# Altium schematic sheet Extension_Connectors.SchDoc: Init Title in DocParam
size A3; Organization: Use Organization_Name in ProjParam; Address1: Eliot Ferragni; Address2: STI-IMT-LSRO; Address3: EPFL; Address4: CH-1015 LAUSANNE; DocumentNumber: 8; Revision: A; SheetNumber: 8; SheetTotal: 10; ApprovedBy: Init ApprovedBy in DocParam; CheckedBy: Init CheckedBy in DocParam; Author: Init Author in DocParam; CompanyName: Init CompanyName in DocParam; DrawnBy: Init DrawBy in DocParam; Engineer: Init Engineer in DocParam; Title2: Init Title2 in DocParam; DocumentName: Init DocumentName in DocParam; ProjectName: Init ProjectName in DocParam
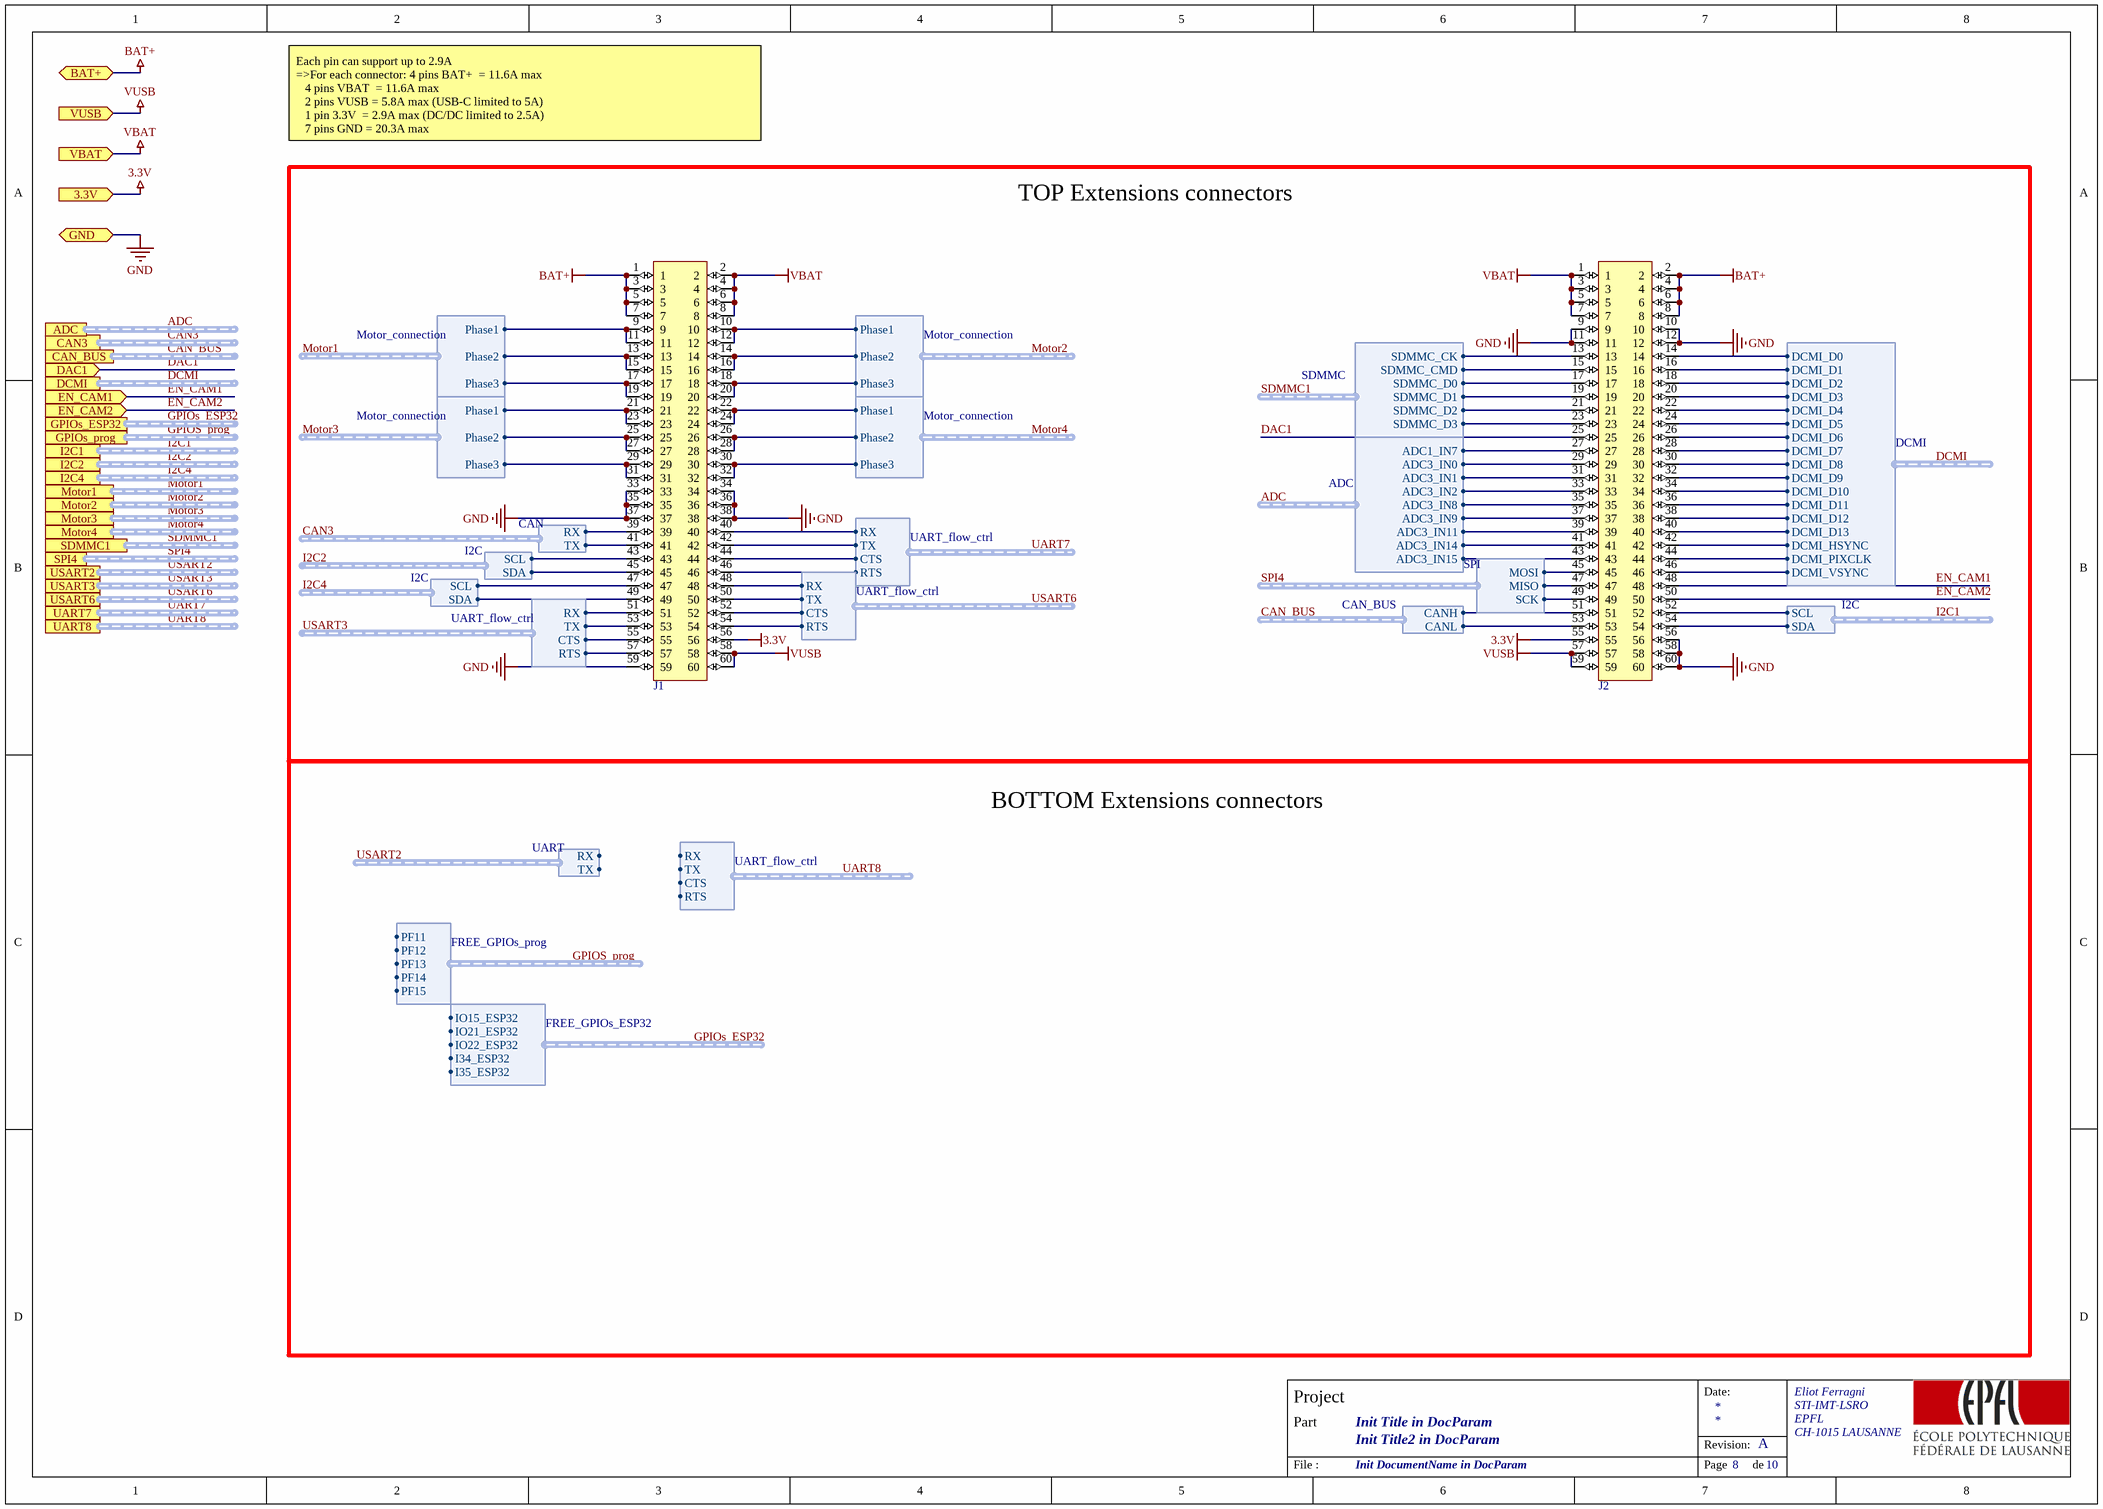
[diagram p0: Extension_Connectors.SchDoc]

## Parts
J1  FLE-130-01-G-DV-A  [FLE-130-01-G-DV-A]  (value not drawn)
J2  FLE-130-01-G-DV-A  [FLE-130-01-G-DV-A]  (value not drawn)

## Blocks framed on the sheet
TOP Extensions connectors: J1 J2

## Ports
3.3V (in), ADC (harness ADC), BAT+ (bidir), CAN3 (harness CAN), CAN_BUS (harness CAN_BUS), DAC1 (in), DCMI (harness DCMI), EN_CAM1 (in), EN_CAM2 (in), GND (bidir), GPIOs_ESP32 (harness FREE_GPIOs_ESP32), GPIOs_prog (harness FREE_GPIOs_prog), I2C1 (harness I2C), I2C2 (harness I2C), I2C4 (harness I2C), Motor1 (harness Motor_connection), Motor2 (harness Motor_connection), Motor3 (harness Motor_connection), Motor4 (harness Motor_connection), SDMMC1 (harness SDMMC), SPI4 (harness SPI), UART7 (harness UART_flow_ctrl), UART8 (harness UART_flow_ctrl), USART2 (harness UART), USART3 (harness UART_flow_ctrl), USART6 (harness UART_flow_ctrl), VBAT (in), VUSB (in)

## Harnesses
I2C: SDA, SCL
CAN: TX, RX
DCMI: DCMI_D0, DCMI_D1, DCMI_D2, DCMI_D3, DCMI_D4, DCMI_D5, DCMI_D7, DCMI_D8, DCMI_D9, DCMI_D10, DCMI_D11, DCMI_D12, DCMI_D13, DCMI_HSYNC, DCMI_PIXCLK, DCMI_VSYNC, DCMI_D6
SDMMC: SDMMC_CK, SDMMC_CMD, SDMMC_D0, SDMMC_D1, SDMMC_D2, SDMMC_D3
SPI: MISO, MOSI, SCK
UART_flow_ctrl: RX, TX, CTS, RTS
ADC: ADC1_IN7, ADC3_IN0, ADC3_IN1, ADC3_IN2, ADC3_IN8, ADC3_IN9, ADC3_IN11, ADC3_IN14, ADC3_IN15
UART: RX, TX
FREE_GPIOs_prog: PF13, PF14, PF12, PF15, PF11
FREE_GPIOs_ESP32: IO22_ESP32, IO21_ESP32, I34_ESP32, IO15_ESP32, I35_ESP32
CAN_BUS: CANL, CANH
Motor_connection: Phase1, Phase2, Phase3

## Nets
3.3V: J1.56 J2.55 ; port 3.3V
BAT+: J1.1 J1.3 J1.5 J1.7 J2.2 J2.4 J2.6 J2.8 ; port BAT+
GND: J1.33 J1.34 J1.35 J1.36 J1.37 J1.38 J1.59 J2.9 J2.10 J2.11 J2.12 J2.56 J2.58 J2.60 ; port GND
VBAT: J1.2 J1.4 J1.6 J1.8 J2.1 J2.3 J2.5 J2.7 ; port VBAT
VUSB: J1.58 J1.60 J2.57 J2.59 ; port VUSB
ADC.ADC1_IN7: J2.27 ; port ADC.ADC1_IN7
ADC.ADC3_IN0: J2.29 ; port ADC.ADC3_IN0
ADC.ADC3_IN1: J2.31 ; port ADC.ADC3_IN1
ADC.ADC3_IN2: J2.33 ; port ADC.ADC3_IN2
ADC.ADC3_IN8: J2.35 ; port ADC.ADC3_IN8
ADC.ADC3_IN9: J2.37 ; port ADC.ADC3_IN9
ADC.ADC3_IN11: J2.39 ; port ADC.ADC3_IN11
ADC.ADC3_IN14: J2.41 ; port ADC.ADC3_IN14
ADC.ADC3_IN15: J2.43 ; port ADC.ADC3_IN15
CAN3.RX: J1.39 ; port CAN3.RX
CAN3.TX: J1.41 ; port CAN3.TX
CAN_BUS.CANH: J2.51 ; port CAN_BUS.CANH
CAN_BUS.CANL: J2.53 ; port CAN_BUS.CANL
DAC1: J2.25 ; port DAC1
DCMI.DCMI_D0: J2.14 ; port DCMI.DCMI_D0
DCMI.DCMI_D1: J2.16 ; port DCMI.DCMI_D1
DCMI.DCMI_D2: J2.18 ; port DCMI.DCMI_D2
DCMI.DCMI_D3: J2.20 ; port DCMI.DCMI_D3
DCMI.DCMI_D4: J2.22 ; port DCMI.DCMI_D4
DCMI.DCMI_D5: J2.24 ; port DCMI.DCMI_D5
DCMI.DCMI_D6: J2.26 ; port DCMI.DCMI_D6
DCMI.DCMI_D7: J2.28 ; port DCMI.DCMI_D7
DCMI.DCMI_D8: J2.30 ; port DCMI.DCMI_D8
DCMI.DCMI_D9: J2.32 ; port DCMI.DCMI_D9
DCMI.DCMI_D10: J2.34 ; port DCMI.DCMI_D10
DCMI.DCMI_D11: J2.36 ; port DCMI.DCMI_D11
DCMI.DCMI_D12: J2.38 ; port DCMI.DCMI_D12
DCMI.DCMI_D13: J2.40 ; port DCMI.DCMI_D13
DCMI.DCMI_HSYNC: J2.42 ; port DCMI.DCMI_HSYNC
DCMI.DCMI_PIXCLK: J2.44 ; port DCMI.DCMI_PIXCLK
DCMI.DCMI_VSYNC: J2.46 ; port DCMI.DCMI_VSYNC
EN_CAM1: J2.48 ; port EN_CAM1
EN_CAM2: J2.50 ; port EN_CAM2
I2C1.SCL: J2.52 ; port I2C1.SCL
I2C1.SDA: J2.54 ; port I2C1.SDA
I2C2.SCL: J1.43 ; port I2C2.SCL
I2C2.SDA: J1.45 ; port I2C2.SDA
I2C4.SCL: J1.47 ; port I2C4.SCL
I2C4.SDA: J1.49 ; port I2C4.SDA
Motor1.Phase1: J1.9 J1.11 ; port Motor1.Phase1
Motor1.Phase2: J1.13 J1.15 ; port Motor1.Phase2
Motor1.Phase3: J1.17 J1.19 ; port Motor1.Phase3
Motor2.Phase1: J1.10 J1.12 ; port Motor2.Phase1
Motor2.Phase2: J1.14 J1.16 ; port Motor2.Phase2
Motor2.Phase3: J1.18 J1.20 ; port Motor2.Phase3
Motor3.Phase1: J1.21 J1.23 ; port Motor3.Phase1
Motor3.Phase2: J1.25 J1.27 ; port Motor3.Phase2
Motor3.Phase3: J1.29 J1.31 ; port Motor3.Phase3
Motor4.Phase1: J1.22 J1.24 ; port Motor4.Phase1
Motor4.Phase2: J1.26 J1.28 ; port Motor4.Phase2
Motor4.Phase3: J1.30 J1.32 ; port Motor4.Phase3
SDMMC1.SDMMC_CK: J2.13 ; port SDMMC1.SDMMC_CK
SDMMC1.SDMMC_CMD: J2.15 ; port SDMMC1.SDMMC_CMD
SDMMC1.SDMMC_D0: J2.17 ; port SDMMC1.SDMMC_D0
SDMMC1.SDMMC_D1: J2.19 ; port SDMMC1.SDMMC_D1
SDMMC1.SDMMC_D2: J2.21 ; port SDMMC1.SDMMC_D2
SDMMC1.SDMMC_D3: J2.23 ; port SDMMC1.SDMMC_D3
SPI4.MISO: J2.47 ; port SPI4.MISO
SPI4.MOSI: J2.45 ; port SPI4.MOSI
SPI4.SCK: J2.49 ; port SPI4.SCK
UART7.CTS: J1.44 ; port UART7.CTS
UART7.RTS: J1.46 ; port UART7.RTS
UART7.RX: J1.40 ; port UART7.RX
UART7.TX: J1.42 ; port UART7.TX
USART3.CTS: J1.55 ; port USART3.CTS
USART3.RTS: J1.57 ; port USART3.RTS
USART3.RX: J1.51 ; port USART3.RX
USART3.TX: J1.53 ; port USART3.TX
USART6.CTS: J1.52 ; port USART6.CTS
USART6.RTS: J1.54 ; port USART6.RTS
USART6.RX: J1.48 ; port USART6.RX
USART6.TX: J1.50 ; port USART6.TX

## Buses and harness runs
harness ADC = port ADC
harness CAN3 = port CAN3
harness CAN_BUS = port CAN_BUS
harness DCMI = port DCMI
harness GPIOs_ESP32 = port GPIOs_ESP32
harness GPIOS_prog = port GPIOs_prog
harness I2C1 = port I2C1
harness I2C2 = port I2C2
harness I2C4 = port I2C4
harness Motor1 = port Motor1
harness Motor2 = port Motor2
harness Motor3 = port Motor3
harness Motor4 = port Motor4
harness SDMMC1 = port SDMMC1
harness SPI4 = port SPI4
harness UART7 = port UART7
harness UART8 = port UART8
harness USART2 = port USART2
harness USART3 = port USART3
harness USART6 = port USART6

## Notes on the sheet
- Each pin can support up to 2.9A
  =>For each connector:	4 pins BAT+ 	= 11.6A max
  4 pins VBAT 	= 11.6A max
  2 pins VUSB	= 5.8A max (USB-C limited to 5A)
  1 pin 3.3V		= 2.9A max (DC/DC limited to 2.5A)
  7 pins GND	= 20.3A max
- BOTTOM Extensions connectors
- Date:
- Project
- Part
- Revision:
- File :
- Page
- de

## Library data of the parts
J1 J2 = FLE-130-01-G-DV-A: .050 MICRO STRIPS; Manufacturer: Samtec Inc.; Connector Type: Receptacle; Style: Board to Board or Cable; Number of Positions: 60; Number of Positions Loaded: All; Pitch - Mating: 0.050" (1.27mm); Current Rating: 2A per Contact; Supplier 1: Digi-Key; Manufacturer Part Number: FLE-130-01-G-DV-A; RoHS: RoHS Compliant; Category: Connectors, Interconnects; Stock 1: 179; Pricing 1: 1=7.89, 10=7.203, 100=5.488, 500=4.6305, 1000=4.37325 (USD); Packaging: Tube; Part Status: Active; Contact Type: Female Socket; Row Spacing - Mating: 0.050" (1.27mm); Mounting Type: Surface Mount; Termination: Solder; Fastening Type: Push-Pull; Contact Finish - Mating: Gold; Contact Finish Thickness - Mating: 10.0µin (0.25µm); Insulation Color: Black; Insulation Height: 0.172" (4.37mm); Contact Length - Post: -; Operating Temperature: -55°C ~ 125°C; Material Flammability Rating: -; Contact Finish - Post: Gold; Mated Stacking Heights: -; Ingress Protection: -; Features: Board Guide; Voltage Rating: -; Applications: -; Insulation Material: Liquid Crystal Polymer (LCP); Contact Shape: Square; Contact Material: Phosphor Bronze; Contact Finish Thickness - Post: 3.00µin (0.076µm); ComponentLink1URL: http://suddendocs.samtec.com/prints/fle-1xx-xx-xx-dv-x-mkt.pdf; ComponentLink1Description: http://suddendocs.samtec.com/prints/fle-1xx-xx-xx-dv-x-mkt.pdf; Supplier Part Number 1: SAM10493-ND